# Altium schematic sheet Signal Outputs.SchDoc: Signal Output
size A3
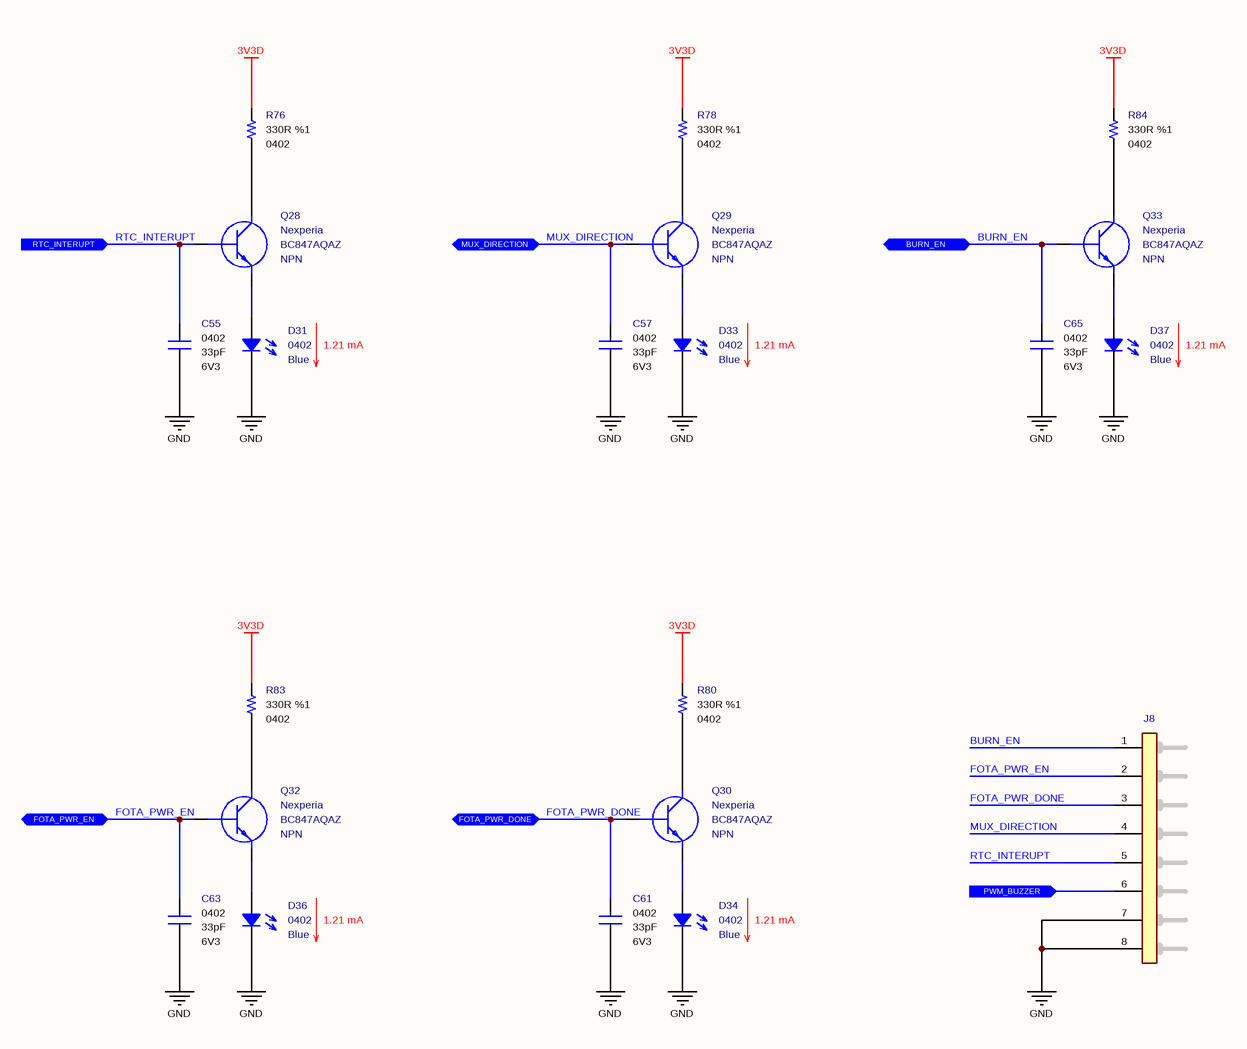
[diagram p0: Signal Outputs.SchDoc]

## Parts
C55  value 33pF  Case: 0402  Voltage: 6V3  [CAPACITOR_0402]  (hidden comment: Multilayer Ceramic Capacitor)
C57  value 33pF  Case: 0402  Voltage: 6V3  [CAPACITOR_0402]  (hidden comment: Multilayer Ceramic Capacitor)
C61  value 33pF  Case: 0402  Voltage: 6V3  [CAPACITOR_0402]  (hidden comment: Multilayer Ceramic Capacitor)
C63  value 33pF  Case: 0402  Voltage: 6V3  [CAPACITOR_0402]  (hidden comment: Multilayer Ceramic Capacitor)
C65  value 33pF  Case: 0402  Voltage: 6V3  [CAPACITOR_0402]  (hidden comment: Multilayer Ceramic Capacitor)
D31  Case: 0402  Color: Blue  [LED_0402]  (hidden comment: SMD LED (Blue))
D33  Case: 0402  Color: Blue  [LED_0402]  (hidden comment: SMD LED (Blue))
D34  Case: 0402  Color: Blue  [LED_0402]  (hidden comment: SMD LED (Blue))
D36  Case: 0402  Color: Blue  [LED_0402]  (hidden comment: SMD LED (Blue))
D37  Case: 0402  Color: Blue  [LED_0402]  (hidden comment: SMD LED (Blue))
J8  2.54 mm Pitch 8P Male Connector  [8P Header]  (value not drawn)
Q28  Manufacturer_Name: Nexperia  Manufacturer_Part_Number: BC847AQAZ  Polarity: NPN  [SOT1215]  (hidden comment: Bipolar NPN Transistors)
Q29  Manufacturer_Name: Nexperia  Manufacturer_Part_Number: BC847AQAZ  Polarity: NPN  [SOT1215]  (hidden comment: Bipolar NPN Transistors)
Q30  Manufacturer_Name: Nexperia  Manufacturer_Part_Number: BC847AQAZ  Polarity: NPN  [SOT1215]  (hidden comment: Bipolar NPN Transistors)
Q32  Manufacturer_Name: Nexperia  Manufacturer_Part_Number: BC847AQAZ  Polarity: NPN  [SOT1215]  (hidden comment: Bipolar NPN Transistors)
Q33  Manufacturer_Name: Nexperia  Manufacturer_Part_Number: BC847AQAZ  Polarity: NPN  [SOT1215]  (hidden comment: Bipolar NPN Transistors)
R76  value 330R  Tolerance: %1  Case: 0402  [RESISTOR_0402]  (hidden comment: Thick Film Resistor)
R78  value 330R  Tolerance: %1  Case: 0402  [RESISTOR_0402]  (hidden comment: Thick Film Resistor)
R80  value 330R  Tolerance: %1  Case: 0402  [RESISTOR_0402]  (hidden comment: Thick Film Resistor)
R83  value 330R  Tolerance: %1  Case: 0402  [RESISTOR_0402]  (hidden comment: Thick Film Resistor)
R84  value 330R  Tolerance: %1  Case: 0402  [RESISTOR_0402]  (hidden comment: Thick Film Resistor)

## Ports
BURN_EN (bidir), FOTA_PWR_DONE (bidir), FOTA_PWR_EN (bidir), MUX_DIRECTION (bidir), PWM_BUZZER (in), RTC_INTERUPT (in)

## Nets
3V3D: R76.2 R78.2 R80.2 R83.2 R84.2
GND: C55.2 C57.2 C61.2 C63.2 C65.2 D31.1 D33.1 D34.1 D36.1 D37.1 J8.7(Pin-7) J8.8(Pin-8)
BURN_EN: C65.1 J8.1(Pin-1) Q33.1(B) ; port BURN_EN
FOTA_PWR_DONE: C61.1 J8.3(Pin-3) Q30.1(B) ; port FOTA_PWR_DONE
FOTA_PWR_EN: C63.1 J8.2(Pin-2) Q32.1(B) ; port FOTA_PWR_EN
MUX_DIRECTION: C57.1 J8.4(Pin-4) Q29.1(B) ; port MUX_DIRECTION
PWM_BUZZER: J8.6(Pin-6) ; port PWM_BUZZER
RTC_INTERUPT: C55.1 J8.5(Pin-5) Q28.1(B) ; port RTC_INTERUPT
NetD31_2: D31.2 Q28.2(E)
NetD33_2: D33.2 Q29.2(E)
NetD34_2: D34.2 Q30.2(E)
NetD36_2: D36.2 Q32.2(E)
NetD37_2: D37.2 Q33.2(E)
NetQ28_3: Q28.3(C) R76.1
NetQ29_3: Q29.3(C) R78.1
NetQ30_3: Q30.3(C) R80.1
NetQ32_3: Q32.3(C) R83.1
NetQ33_3: Q33.3(C) R84.1

## Notes on the sheet
- 1.21 mA
- Title
- Size:
- Date:
- A3
- Number:
- Time:
- Revision:
- Sheet
- of
- File:

## Library data of the parts
C55 C57 C61 C63 C65 = Capacitor - 33pF [0402-6V3]: Capacitor - 33pF [0402] (Ceramic); Manufacturer Name: Kemet; Manufacturer Part Number: C0402C330J9RACAUTO; Dielectric: X7R; Tolerance: 10%; Height: 0.5mm; Maximum Operating Temperature: +125; Minimum Operating Temperature: -55; ROHS: Yes; ComponentLink1Description: DataSheet; ComponentLink1URL: https://api.kemet.com/component-edge/download/datasheet/C0402C330J9RACAUTO.pdf; ComponentLink2Description: Mouser; ComponentLink2URL: https://www.mouser.com/Search/Refine.aspx?Keyword=80-C0402C330J9RAUTO; Supplier 1: Mouser; Supplier Part Number 1: 80-C0402C330J9RAUTO; Mouser Part Number: 80-C0402C330J9RAUTO
D31 D33 D34 D36 D37 = Diode - LED (0402-Blue): Standard LEDs - SMD PICOLEDTM;BLUE LED; 25M @ 5MA; Manufacturer_Name: ROHM Semiconductor; Manufacturer_Part_Number: SMLP13BC8TT86; Mouser_Part_Number: 755-SMLP13BC8TT86; ROHS: Yes; ComponentLink1Description: DataSheet; ComponentLink1URL: https://d1d2qsbl8m0m72.cloudfront.net/en/products/databook/datasheet/opto/led/chip_mono/sml-p1-e.pdf; ComponentLink2Description: Mouser; ComponentLink2URL: https://www.mouser.com.tr/ProductDetail/ROHM-Semiconductor/SMLP13BC8TT86?qs=%2Fha2pyFaduidYDgXFKL%252BNZwCVZNUI4FlyPWWbVDx1b6ABmzS%252BS2f0w%3D%3D; Supplier 1: Mouser; Supplier 2: Digi-Key; Supplier Part Number 1: 755-SMLP13BC8TT86; Supplier Part Number 2: 846-1112-1-ND
J8 = Connector - Male Header 8P (2.54): Headers & Wire Housings BREAKAWAY HDR VERT 8; Manufacturer Name: Molex; Position: 8; Row: 1; Pitch: 2.54 mm; Manufacturer Part Number: 22-28-4083; Mouser Part Number: 538-22-28-4083; ROHS: Yes; ComponentLink1Description: DataSheet; ComponentLink1URL: https://www.mouser.com.tr/datasheet/2/276/0022284063_PCB_HEADERS-228265.pdf; ComponentLink2Description: Mouser; ComponentLink2URL: https://www.mouser.com.tr/ProductDetail/Molex/22-28-4083/?qs=%2Fha2pyFaduguMWEp6M%252Bj0x6fHxUvnRGD%252BIxBoa6MO5w%3D
Q28-Q30 Q32 Q33 = Transistor - BC847: Bipolar Transistors - BJT BC847AQA/DFN1010D-3/REEL 7" Q2; Mouser_Part_Number: 771-BC847AQAZ; ComponentLink1Description: DataSheet; ComponentLink1URL: https://www.mouser.com.tr/datasheet/2/916/BC847XQA_SER-1598405.pdf; ComponentLink2Description: Mouser; ComponentLink2URL: https://www.mouser.com.tr/ProductDetail/Nexperia/BC847AQAZ?qs=%2Fha2pyFaduhKMCPKNtQimeJpXTw9z4AqURd2YARs8DVICZNv3AT9Dw%3D%3D; Case: DFN-1010D-3; Supplier 1: Mouser; Supplier 2: Digi-Key; Supplier Part Number 1: 771-BC847AQAZ; Supplier Part Number 2: 1727-2545-1-ND
R76 R78 R80 R83 R84 = Resistor - 330R: Thick Film Resistors - SMD 1/16 W 330 Ohm 1%; Manufacturer Name: Vishay; Manufacturer Part Number: CRCW0402330RFKED; Height: 0.4mm; ComponentLink1Description: DataSheet; ComponentLink1URL: https://www.mouser.com.tr/datasheet/2/427/dcrcwe3-1762152.pdf; ComponentLink2Description: Mouser; ComponentLink2URL: https://www.mouser.com.tr/ProductDetail/Vishay-Dale/CRCW0402330RFKED?qs=sGAEpiMZZMu61qfTUdNhG2DpbjADlD3GGS6SwBlLi5Q%3D; Supplier 1: Mouser; Supplier 2: Digi-Key; Supplier Part Number 2: 541-330LCT-ND; Supplier Part Number 1: 71-CRCW0402-330-E3; Mouser Part Number: 71-CRCW0402-330-E3